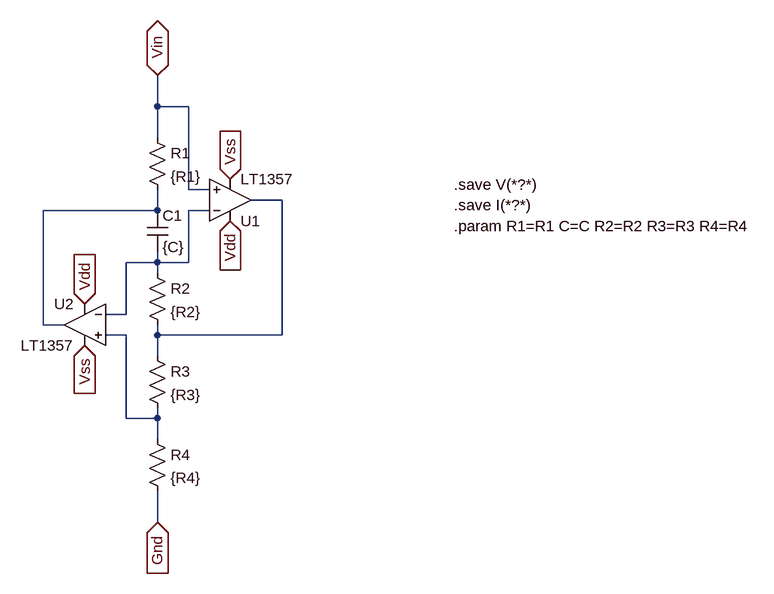
[diagram p0: schematic Gyr2.asc]
Gyr2.asc, the LTspice schematic file:
Version 4
SHEET 1 880 696
WIRE -48 -48 -48 -96
WIRE 0 -48 -48 -48
WIRE -48 0 -48 -48
WIRE 0 80 0 -48
WIRE 32 80 0 80
WIRE 144 96 96 96
WIRE -48 112 -48 80
WIRE -48 112 -224 112
WIRE 32 112 0 112
WIRE -48 192 -48 176
WIRE -48 192 -96 192
WIRE 0 192 0 112
WIRE 0 192 -48 192
WIRE -48 208 -48 192
WIRE -96 272 -96 192
WIRE -96 272 -128 272
WIRE -224 288 -224 112
WIRE -192 288 -224 288
WIRE -96 304 -128 304
WIRE -48 304 -48 288
WIRE 144 304 144 96
WIRE 144 304 -48 304
WIRE -48 336 -48 304
WIRE -96 432 -96 304
WIRE -48 432 -48 416
WIRE -48 432 -96 432
WIRE -48 464 -48 432
WIRE -48 592 -48 544
FLAG -160 256 Vdd
IOPIN -160 256 In
FLAG 64 128 Vdd
IOPIN 64 128 In
FLAG -160 320 Vss
IOPIN -160 320 In
FLAG 64 64 Vss
IOPIN 64 64 In
FLAG -48 592 Gnd
IOPIN -48 592 In
FLAG -48 -96 Vin
IOPIN -48 -96 BiDir
SYMBOL OpAmps\\LT1357 64 160 M180
SYMATTR InstName U1
SYMBOL res -64 -16 R0
SYMATTR InstName R1
SYMATTR Value {R1}
SYMBOL cap -64 112 R0
SYMATTR InstName C1
SYMATTR Value {C}
SYMBOL res -64 192 R0
SYMATTR InstName R2
SYMATTR Value {R2}
SYMBOL OpAmps\\LT1357 -160 224 M0
SYMATTR InstName U2
SYMBOL res -64 320 R0
SYMATTR InstName R3
SYMATTR Value {R3}
SYMBOL res -64 448 R0
SYMATTR InstName R4
SYMATTR Value {R4}
TEXT 408 72 Left 2 !.save V(*?*)
TEXT 408 104 Left 2 !.save I(*?*)
TEXT 408 136 Left 2 !.param R1=R1 C=C R2=R2 R3=R3 R4=R4

The netlist it stands for:
* Gyr2.asc
XU1 Vin N003 Vdd Vss N001 LT1357  ; pins In+ In- V+ V- OUT
R1 Vin N002 {R1}
C1 N002 N003 {C}
R2 N003 N001 {R2}
XU2 N004 N003 Vdd Vss N002 LT1357  ; pins In+ In- V+ V- OUT
R3 N001 N004 {R3}
R4 N004 Gnd {R4}
.save V(*?*)
.save I(*?*)
.param R1=R1 C=C R2=R2 R3=R3 R4=R4
.backanno
.end